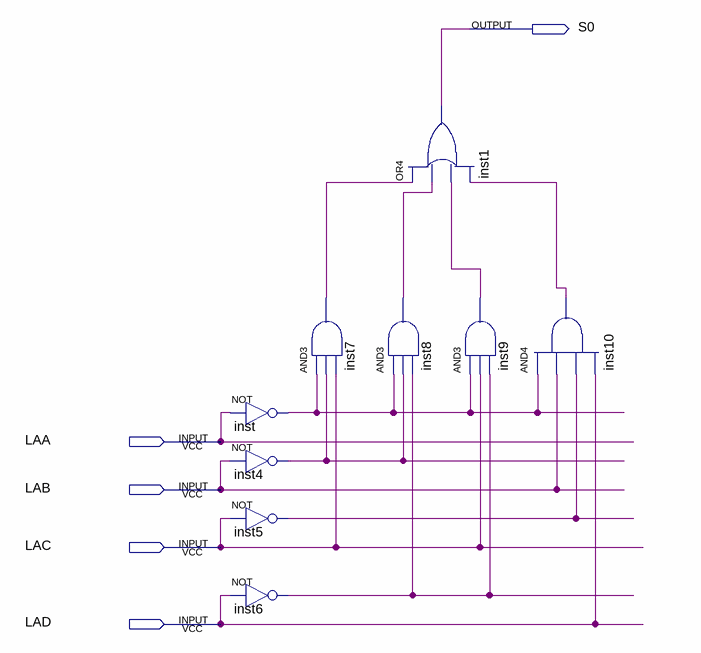
[diagram p0: schematic sheet]
// Quartus schematic Linha0.bdf as structural Verilog: 9 symbols, 5 pins
module Linha0 (
  input  LAA,
  input  LAB,
  input  LAC,
  input  LAD,
  output S0
);

  wire inst4_out, inst5_out, inst6_out, inst7_out, inst8_out, inst9_out, inst10_out, inst_out;

  not inst (inst_out, LAA);
  not inst4 (inst4_out, LAB);
  not inst5 (inst5_out, LAC);
  not inst6 (inst6_out, LAD);
  and inst7 (inst7_out, inst_out, inst4_out, LAC);
  or inst1 (S0, inst7_out, inst8_out, inst9_out, inst10_out);
  and inst8 (inst8_out, inst_out, inst4_out, inst6_out);
  and inst9 (inst9_out, inst_out, LAC, inst6_out);
  and inst10 (inst10_out, inst_out, LAB, inst5_out, LAD);
endmodule
